# Altium schematic sheet Sheet2.SchDoc
size A4; SheetNumber: 1; SheetTotal: 1
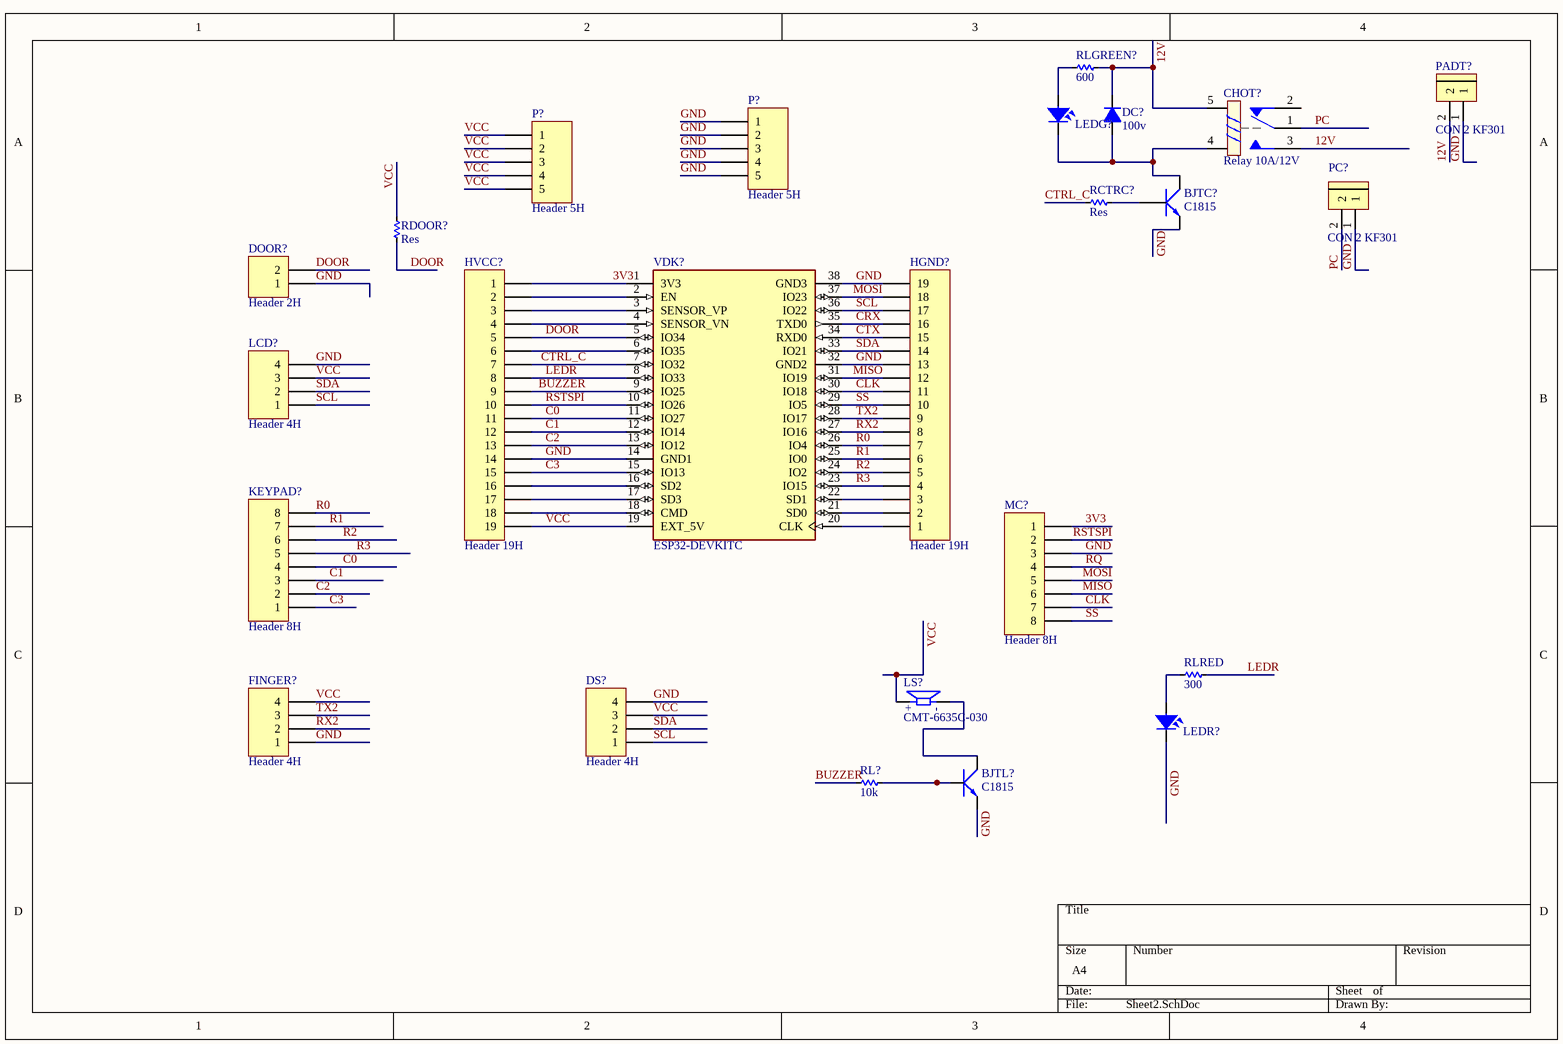
[diagram p0: Sheet2.SchDoc]

## Parts
(Parts that share a designator on the sheet are numbered #1, #2 ... from top to bottom, then left to right.)
BJTC?  C1815  [TO92]
BJTL?  C1815  [TO92]
CHOT?  Relay 10A/12V  [RELAY 5]
DC?  100v  [DIODE 1A]
DOOR?  Header 2H  [HDR1X2H]
DS?  Header 4H  [HDR1X4H]
FINGER?  Header 4H  [HDR1X4H]
HGND?  Header 19H  [HDR1X19H]
HVCC?  Header 19H  [HDR1X19H]
KEYPAD?  Header 8H  [HDR1X8H]
LCD?  Header 4H  [HDR1X4H]
LEDG?  LED  [LED-3MM-YELLOW]  (value not drawn)
LEDR?  LED  [LED-3MM-YELLOW]  (value not drawn)
LS?  CMT-6635C-030  [CUI_CMT-6635C-030]
MC?  Header 8H  [HDR1X8H]
P?#1  Header 5H  [HDR1X5H]
P?#2  Header 5H  [HDR1X5H]
PADT?  CON 2 KF301  [Con 2 KF301 5.08]
PC?  CON 2 KF301  [Con 2 KF301 5.08]
RCTRC?  Res  [RES-1/2W]
RDOOR?  Res  [RES-1/2W]
RL?  10k  [RES-1/2W]
RLGREEN?  600  [RES-1/2W]
RLRED  300  [RES-1/2W]
VDK?  ESP32-DEVKITC  [MODULE_ESP32-DEVKITC]

## Nets
3V3: HVCC?.1 MC?.1 VDK?.1(3V3)
12V: CHOT?.3 CHOT?.5 DC?.2(K) PADT?.2 RLGREEN?.1
BUZZER: HVCC?.9 RL?.2 VDK?.9(IO25)
C0: HVCC?.11 KEYPAD?.4 VDK?.11(IO27)
C1: HVCC?.12 KEYPAD?.3 VDK?.12(IO14)
C2: HVCC?.13 KEYPAD?.2 VDK?.13(IO12)
C3: HVCC?.15 KEYPAD?.1 VDK?.15(IO13)
CLK: HGND?.11 MC?.7 VDK?.30(IO18)
CRX: HGND?.16 VDK?.35(TXD0)
CTRL_C: HVCC?.7 RCTRC?.2 VDK?.7(IO32)
CTX: HGND?.15 VDK?.34(RXD0)
DOOR: DOOR?.2 HVCC?.5 RDOOR?.2 VDK?.5(IO34)
GND: BJTC?.1(E) BJTL?.1(E) DOOR?.1 DS?.4 FINGER?.1 HGND?.13 HGND?.19 HVCC?.14 LCD?.4 LEDR?.2 MC?.3 P?#1.1 P?#1.2 P?#1.3 P?#1.4 P?#1.5 PADT?.1 PC?.1 VDK?.14(GND1) VDK?.32(GND2) VDK?.38(GND3)
LEDR: HVCC?.8 RLRED.1 VDK?.8(IO33)
MISO: HGND?.12 MC?.6 VDK?.31(IO19)
MOSI: HGND?.18 MC?.5 VDK?.37(IO23)
PC: CHOT?.1 PC?.2
R0: HGND?.7 KEYPAD?.8 VDK?.26(IO4)
R1: HGND?.6 KEYPAD?.7 VDK?.25(IO0)
R2: HGND?.5 KEYPAD?.6 VDK?.24(IO2)
R3: HGND?.4 KEYPAD?.5 VDK?.23(IO15)
RQ: MC?.4
RSTSPI: HVCC?.10 MC?.2 VDK?.10(IO26)
RX2: FINGER?.2 HGND?.8 VDK?.27(IO16)
SCL: DS?.1 HGND?.17 LCD?.1 VDK?.36(IO22)
SDA: DS?.2 HGND?.14 LCD?.2 VDK?.33(IO21)
SS: HGND?.10 MC?.8 VDK?.29(IO5)
TX2: FINGER?.3 HGND?.9 VDK?.28(IO17)
VCC: DS?.3 FINGER?.4 HVCC?.19 LCD?.3 LS?.P P?#2.1 P?#2.2 P?#2.3 P?#2.4 P?#2.5 RDOOR?.1 VDK?.19(EXT_5V)
NetBJTC?_2: BJTC?.2(C) CHOT?.4 DC?.1(A) LEDG?.2
NetBJTC?_3: BJTC?.3(B) RCTRC?.1
NetBJTL?_2: BJTL?.2(C) LS?.N
NetBJTL?_3: BJTL?.3(B) RL?.1
NetHGND?_1: HGND?.1 VDK?.20(CLK)
NetHGND?_2: HGND?.2 VDK?.21(SD0)
NetHGND?_3: HGND?.3 VDK?.22(SD1)
NetHVCC?_2: HVCC?.2 VDK?.2(EN)
NetHVCC?_3: HVCC?.3 VDK?.3(SENSOR_VP)
NetHVCC?_4: HVCC?.4 VDK?.4(SENSOR_VN)
NetHVCC?_6: HVCC?.6 VDK?.6(IO35)
NetHVCC?_16: HVCC?.16 VDK?.16(SD2)
NetHVCC?_17: HVCC?.17 VDK?.17(SD3)
NetHVCC?_18: HVCC?.18 VDK?.18(CMD)
NetLEDG?_1: LEDG?.1 RLGREEN?.2
NetLEDR?_1: LEDR?.1 RLRED.2

Not connected (* = marked no-connect by the designer): CHOT? 2

## Notes on the sheet
- (in symbol CMT-6635C-030) +; -

## Library data of the parts
BJTC? BJTL? = C1815: NPN transistor; Value: C9014
CHOT? = Relay 5: Relay SPDT,10A - 12VDC 5 Pin; Value: Relay SPDT, 10A, 12V
DC? = Diode 1N4007: Cắm; Ten_Linh_Kien: Diode 1N4007 1A (DIP); Don_Vi: Con; Ma_Hang: MH001063; Ghi Chu: *; Kieu_Chan: *; Chung_Loai: Cắm
DOOR? = Header 2H: Header, 2-Pin, Right Angle; LatestRevisionDate: 17-Jul-2002; LatestRevisionNote: Re-released for DXP Platform.; Publisher: Altium Limited
DS? FINGER? LCD? = Header 4H: Header, 4-Pin, Right Angle; LatestRevisionDate: 17-Jul-2002; LatestRevisionNote: Re-released for DXP Platform.; Publisher: Altium Limited
HGND? HVCC? = Header 19H: Header, 19-Pin, Right Angle; LatestRevisionDate: 17-Jul-2002; LatestRevisionNote: Re-released for DXP Platform.; Publisher: Altium Limited
KEYPAD? MC? = Header 8H: Header, 8-Pin, Right Angle; LatestRevisionDate: 17-Jul-2002; LatestRevisionNote: Re-released for DXP Platform.; Publisher: Altium Limited
LEDG? LEDR? = LED: LED Single colour Green and Red; Value: LED 3 ly Single Colour
LS? = CMT-6635C-030: 6.6 mm, 3 Vo-p, 80 dB, Through Hole, Magnetic Audio Transducer Buzzer; MF: CUI Devices; Package: CUI Inc.; MP: CMT-6635C-030; CUI_purchase_URL: https://www.cuidevices.com/product/audio/buzzers/audio-transducers/cmt-6635c-030?utm_source=snapeda.com&utm_medium=referral&utm_campaign=snapedaBOM; SnapEDA_Link: https://www.snapeda.com/parts/CMT-6635C-030/CUI%20Devices/view-part/2773120/?ref=snap; Price: None; Value: *; Availability: Unavailable
P?#1 P?#2 = Header 5H: Header, 5-Pin, Right Angle; LatestRevisionDate: 17-Jul-2002; LatestRevisionNote: Re-released for DXP Platform.; Publisher: Altium Limited
PADT? PC? = CON 2 KF301: Cắm; Ma_Hang: MH000987; Ten_Linh_Kien: CON 2 KF301-2P 5.08MM Xanh Dương; Chung_Loai: Cắm; Ghi_Chu: *; Kieu_Chan: *; Don_Vi: Con
RCTRC? RDOOR? RL? RLGREEN? RLRED = Res: Manufacturer: Generic Components; Class: Passive; SubClass: R; Published: 08/06/2000; Publisher: Altium Hobart Technology Centre
VDK? = ESP32-DEVKITC: ESP32-WROOM-32UE series Transceiver; 802.11 b/g/n (Wi-Fi, WiFi, WLAN), Bluetooth Â® Smart Ready 4.x Dual Mode Evaluation Board; MF: Espressif Systems; Value: *; SnapEDA_Link: https://www.snapeda.com/parts/ESP32-DEVKITC/Espressif+Systems/view-part/?ref=snap; MP: ESP32-DEVKITC; Purchase-URL: https://pricing.snapeda.com/search/part/ESP32-DEVKITC/?ref=eda; Check_prices: https://www.snapeda.com/parts/ESP32-DEVKITC/Espressif+Systems/view-part/?ref=eda; Availability: In Stock; Price: None; Package: None